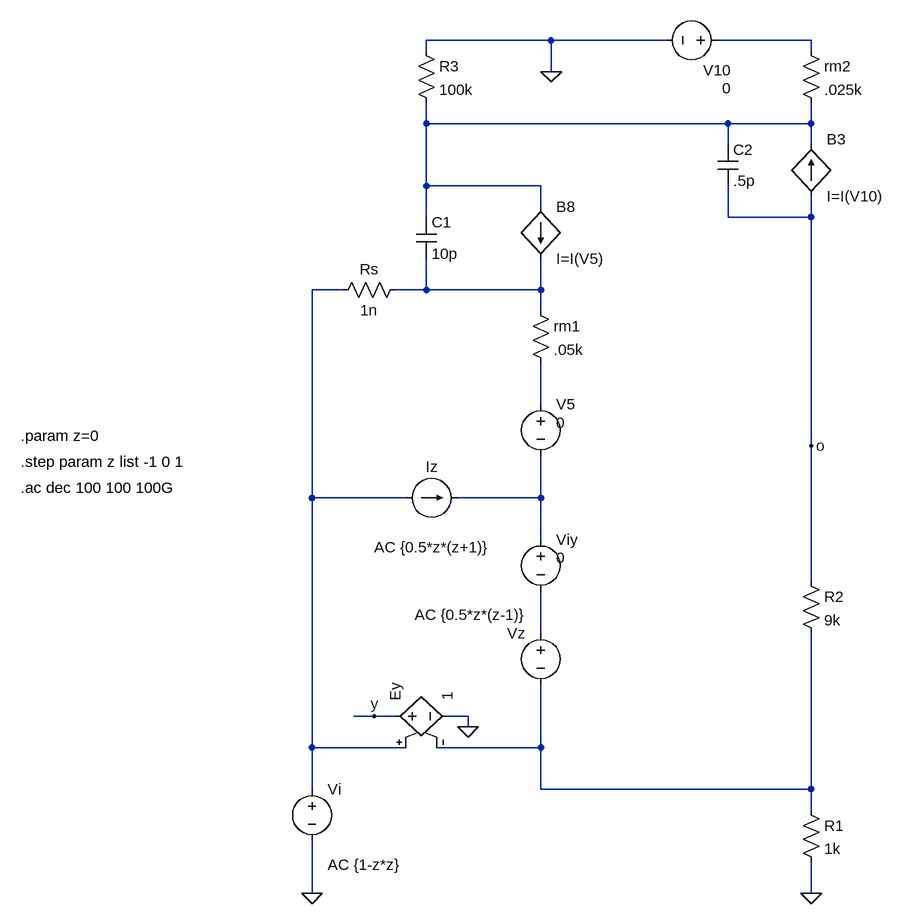
[diagram p0: schematic manual1.asc]
manual1.asc, the LTspice schematic file:
Version 4
SHEET 1 880 1236
WIRE 80 -96 -112 -96
WIRE 256 -96 80 -96
WIRE 480 -96 336 -96
WIRE -112 -80 -112 -96
WIRE 480 -80 480 -96
WIRE 80 -48 80 -96
WIRE -112 32 -112 0
WIRE 352 32 -112 32
WIRE 480 32 480 0
WIRE 480 32 352 32
WIRE 352 64 352 32
WIRE 480 64 480 32
WIRE -112 128 -112 32
WIRE 64 128 -112 128
WIRE 64 160 64 128
WIRE -112 176 -112 128
WIRE 352 176 352 128
WIRE 480 176 480 144
WIRE 480 176 352 176
WIRE -240 288 -288 288
WIRE -112 288 -112 240
WIRE -112 288 -160 288
WIRE 64 288 64 240
WIRE 64 288 -112 288
WIRE 64 320 64 288
WIRE 64 464 64 400
WIRE 480 528 480 176
WIRE -288 608 -288 288
WIRE -144 608 -288 608
WIRE 64 608 64 544
WIRE 64 608 -64 608
WIRE 64 672 64 608
WIRE 480 736 480 528
WIRE 64 816 64 752
WIRE -192 944 -224 944
WIRE -160 944 -192 944
WIRE -48 944 -80 944
WIRE -48 960 -48 944
WIRE -288 992 -288 608
WIRE -144 992 -288 992
WIRE 64 992 64 896
WIRE 64 992 -96 992
WIRE -288 1056 -288 992
WIRE 64 1056 64 992
WIRE 480 1056 480 816
WIRE 480 1056 64 1056
WIRE 480 1088 480 1056
WIRE -288 1216 -288 1136
WIRE 480 1216 480 1168
FLAG -288 1216 0
FLAG 80 -48 0
FLAG 480 1216 0
FLAG -48 960 0
FLAG -192 944 y
FLAG 480 528 o
SYMBOL voltage -288 1040 R0
WINDOW 123 24 132 Left 2
WINDOW 39 0 0 Left 2
SYMATTR Value2 AC {1-z*z}
SYMATTR InstName Vi
SYMATTR Value ""
SYMBOL res -128 -96 R0
SYMATTR InstName R3
SYMATTR Value 100k
SYMBOL res -256 304 R270
WINDOW 0 32 56 VTop 2
WINDOW 3 0 56 VBottom 2
SYMATTR InstName Rs
SYMATTR Value 1n
SYMBOL cap -128 176 R0
SYMATTR InstName C1
SYMATTR Value 10p
SYMBOL bi 64 160 R0
SYMATTR InstName B8
SYMATTR Value I=I(V5)
SYMBOL res 48 304 R0
SYMATTR InstName rm1
SYMATTR Value .05k
SYMBOL voltage 64 448 R0
WINDOW 123 0 0 Left 2
WINDOW 39 0 0 Left 2
WINDOW 3 24 44 Left 2
SYMATTR Value 0
SYMATTR InstName V5
SYMBOL voltage 352 -96 R90
WINDOW 0 46 -5 VRight 2
WINDOW 123 0 0 Left 2
WINDOW 39 0 0 Left 2
WINDOW 3 74 -5 VRight 2
SYMATTR InstName V10
SYMATTR Value 0
SYMBOL res 464 -96 R0
SYMATTR InstName rm2
SYMATTR Value .025k
SYMBOL bi 480 144 M180
WINDOW 0 24 88 Left 2
WINDOW 3 24 0 Left 2
SYMATTR InstName B3
SYMATTR Value I=I(V10)
SYMBOL cap 336 64 R0
SYMATTR InstName C2
SYMATTR Value .5p
SYMBOL res 464 1072 R0
SYMATTR InstName R1
SYMATTR Value 1k
SYMBOL res 464 720 R0
SYMATTR InstName R2
SYMATTR Value 9k
SYMBOL current -144 608 R270
WINDOW 0 32 40 VTop 2
WINDOW 3 -32 40 VBottom 2
WINDOW 123 -60 40 VBottom 2
WINDOW 39 0 0 Left 2
SYMATTR InstName Iz
SYMATTR Value ""
SYMATTR Value2 AC {0.5*z*(z+1)}
SYMBOL voltage 64 656 R0
WINDOW 123 0 0 Left 2
WINDOW 39 0 0 Left 2
WINDOW 3 24 44 Left 2
SYMATTR Value 0
SYMATTR InstName Viy
SYMBOL voltage 64 800 M0
WINDOW 123 24 -12 Left 2
WINDOW 39 0 0 Left 2
SYMATTR Value2 AC {0.5*z*(z-1)}
SYMATTR InstName Vz
SYMATTR Value ""
SYMBOL e -176 944 R270
SYMATTR InstName Ey
SYMATTR Value 1
TEXT -736 592 Left 2 !.ac dec 100 100 100G
TEXT -736 512 Left 2 !.param z=0
TEXT -736 552 Left 2 !.step param z list -1 0 1

The netlist it stands for:
* manual1.asc
Vi N003 0 AC {1-z*z}
R3 0 N002 100k
Rs N003 N004 1n
C1 N002 N004 10p
B8 N002 N004 I=I(V5)
rm1 N004 N005 .05k
V5 N005 N006 0
V10 N001 0 0
rm2 N001 N002 .025k
B3 o N002 I=I(V10)
C2 N002 o .5p
R1 N008 0 1k
R2 o N008 9k
Iz N003 N006 AC {0.5*z*(z+1)}
Viy N006 N007 0
Vz N007 N008 AC {0.5*z*(z-1)}
Ey y 0 N003 N008 1
.ac dec 100 100 100G
.param z=0
.step param z list -1 0 1
.backanno
.end